# Altium schematic sheet 05_LMS7002M_Misc.SchDoc: LMS7002M misc
size A3; Organization: Lime Microsystems; Address1: Surrey Tech Centre; Address2: Guildford GU2 7YG; Address3: Surrey; Address4: United Kingdom; Revision: v1.0; SheetNumber: 5; SheetTotal: 10
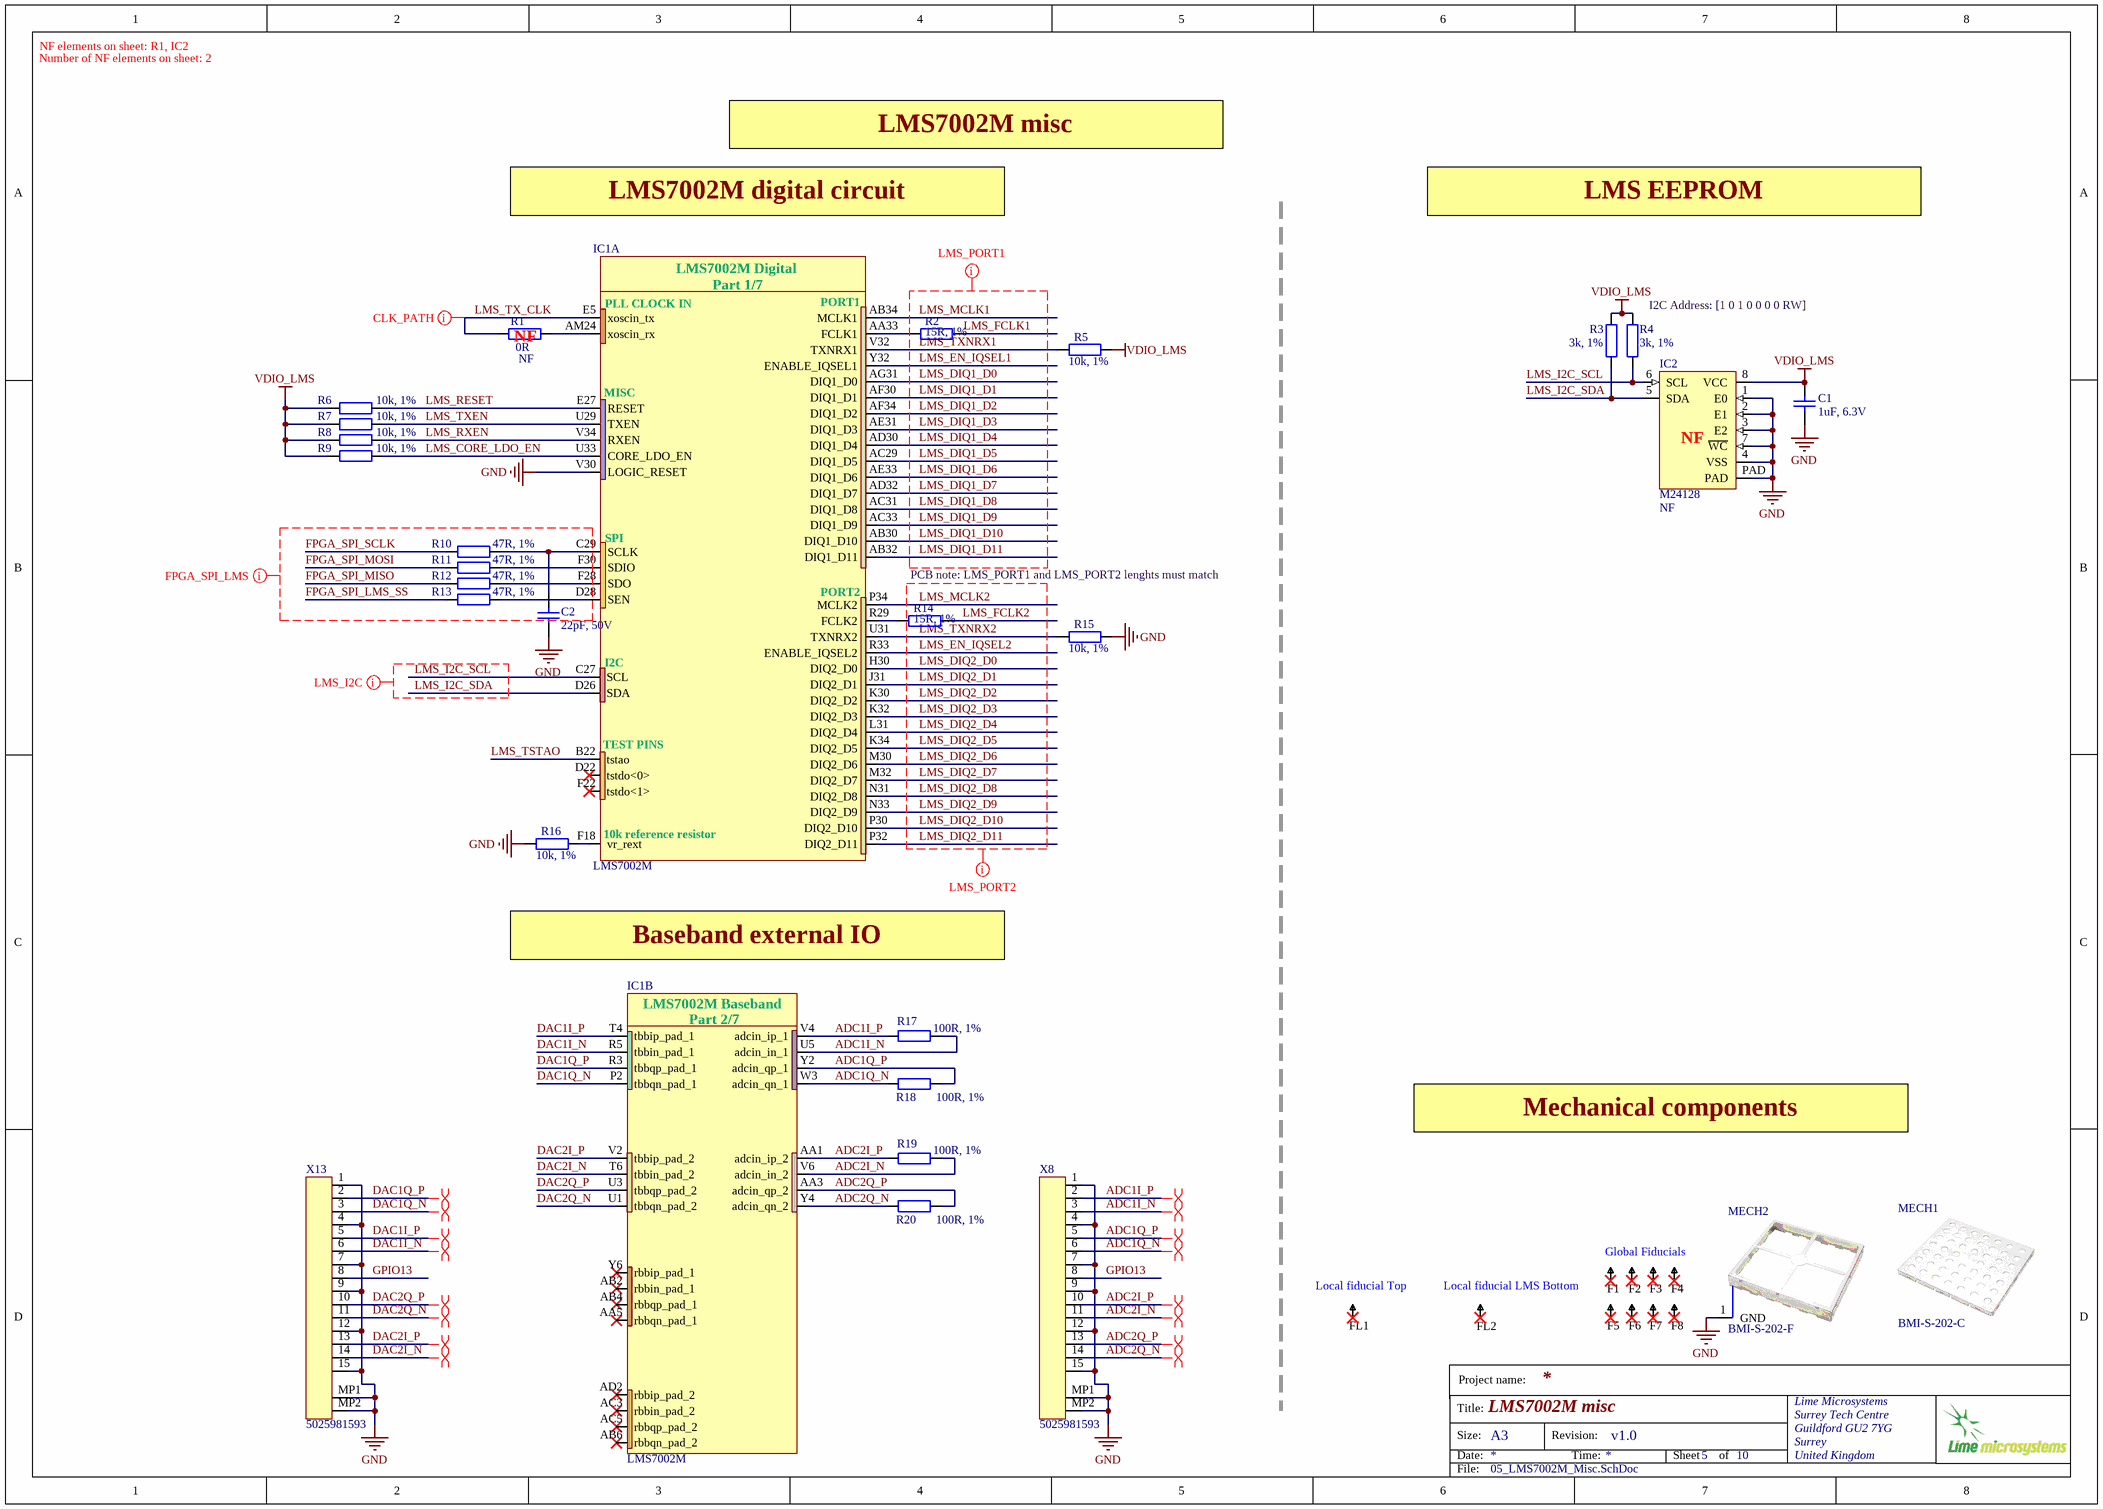
[diagram p0: 05_LMS7002M_Misc.SchDoc]

## Parts
C1  1uF, 6.3V  [CAP0201]
C2  22pF, 50V  [CAP0201]
F1  Fiducial  [Fiducial]  (value not drawn)
F2  Fiducial  [Fiducial]  (value not drawn)
F3  Fiducial  [Fiducial]  (value not drawn)
F4  Fiducial  [Fiducial]  (value not drawn)
F5  Fiducial  [Fiducial]  (value not drawn)
F6  Fiducial  [Fiducial]  (value not drawn)
F7  Fiducial  [Fiducial]  (value not drawn)
F8  Fiducial  [Fiducial]  (value not drawn)
FL1  Fiducial  [Fiducial_local]  (value not drawn)
FL2  Fiducial  [Fiducial_local]  (value not drawn)
IC1  LMS7002M  [LMS7002M_v5_LESS_SILK]  (parts A,B of 7)
IC2  M24128  Assembly Info: NF  [M24128-DFMC6TG]
MECH1  BMI-S-202-C  [BMI-S-202-C_RF_SHIELD_COVER]
MECH2  BMI-S-202-F  [BMI-S-202-F_RF_SHIELD_FRAME_v2]
R1  0R  Assembly Info: NF  [RES0201]
R2  15R, 1%  [RES0201]
R3  3k, 1%  [RES0201]
R4  3k, 1%  [RES0201]
R5  10k, 1%  [RES0201]
R6  10k, 1%  [RES0201]
R7  10k, 1%  [RES0201]
R8  10k, 1%  [RES0201]
R9  10k, 1%  [RES0201]
R10  47R, 1%  [RES0201]
R11  47R, 1%  [RES0201]
R12  47R, 1%  [RES0201]
R13  47R, 1%  [RES0201]
R14  15R, 1%  [RES0201]
R15  10k, 1%  [RES0201]
R16  10k, 1%  [RES0201]
R17  100R, 1%  [RES0201]
R18  100R, 1%  [RES0201]
R19  100R, 1%  [RES0201]
R20  100R, 1%  [RES0201]
X8  5025981593  [5025981593_FPC_connector]
X13  5025981593  [5025981593_FPC_connector]

## Nets
GND: C1.2 C2.1 IC1.V30(LOGIC_RESET) IC2.1(E0) IC2.2(E1) IC2.3(E2) IC2.4(VSS) IC2.7(~{WC}) IC2.PAD MECH2.1(GND) R15.1 R16.2 X8.1 X8.4 X8.7 X8.9 X8.12 X8.15 X8.MP1 X8.MP2 X13.1 X13.4 X13.7 X13.9 X13.12 X13.15 X13.MP1 X13.MP2
VDIO_LMS: C1.1 IC2.8(VCC) R3.2 R4.2 R5.1 R6.2 R7.2 R8.2 R9.2
ADC1I_N: IC1.U5(adcin_in_1) R17.2 X8.3
ADC1I_P: IC1.V4(adcin_ip_1) R17.1 X8.2
ADC1Q_N: IC1.W3(adcin_qn_1) R18.1 X8.6
ADC1Q_P: IC1.Y2(adcin_qp_1) R18.2 X8.5
ADC2I_N: IC1.V6(adcin_in_2) R19.2 X8.11
ADC2I_P: IC1.AA1(adcin_ip_2) R19.1 X8.10
ADC2Q_N: IC1.Y4(adcin_qn_2) R20.1 X8.14
ADC2Q_P: IC1.AA3(adcin_qp_2) R20.2 X8.13
DAC1I_N: IC1.R5(tbbin_pad_1) X13.6
DAC1I_P: IC1.T4(tbbip_pad_1) X13.5
DAC1Q_N: IC1.P2(tbbqn_pad_1) X13.3
DAC1Q_P: IC1.R3(tbbqp_pad_1) X13.2
DAC2I_N: IC1.T6(tbbin_pad_2) X13.14
DAC2I_P: IC1.V2(tbbip_pad_2) X13.13
DAC2Q_N: IC1.U1(tbbqn_pad_2) X13.11
DAC2Q_P: IC1.U3(tbbqp_pad_2) X13.10
FPGA_SPI_LMS_SS: R13.2
FPGA_SPI_MISO: R12.2
FPGA_SPI_MOSI: R11.2
FPGA_SPI_SCLK: R10.2
GPIO13: X8.8 X13.8
LMS_CORE_LDO_EN: IC1.U33(CORE_LDO_EN) R9.1
LMS_DIQ1_D0: IC1.AG31(DIQ1_D0)
LMS_DIQ1_D1: IC1.AF30(DIQ1_D1)
LMS_DIQ1_D2: IC1.AF34(DIQ1_D2)
LMS_DIQ1_D3: IC1.AE31(DIQ1_D3)
LMS_DIQ1_D4: IC1.AD30(DIQ1_D4)
LMS_DIQ1_D5: IC1.AC29(DIQ1_D5)
LMS_DIQ1_D6: IC1.AE33(DIQ1_D6)
LMS_DIQ1_D7: IC1.AD32(DIQ1_D7)
LMS_DIQ1_D8: IC1.AC31(DIQ1_D8)
LMS_DIQ1_D9: IC1.AC33(DIQ1_D9)
LMS_DIQ1_D10: IC1.AB30(DIQ1_D10)
LMS_DIQ1_D11: IC1.AB32(DIQ1_D11)
LMS_DIQ2_D0: IC1.H30(DIQ2_D0)
LMS_DIQ2_D1: IC1.J31(DIQ2_D1)
LMS_DIQ2_D2: IC1.K30(DIQ2_D2)
LMS_DIQ2_D3: IC1.K32(DIQ2_D3)
LMS_DIQ2_D4: IC1.L31(DIQ2_D4)
LMS_DIQ2_D5: IC1.K34(DIQ2_D5)
LMS_DIQ2_D6: IC1.M30(DIQ2_D6)
LMS_DIQ2_D7: IC1.M32(DIQ2_D7)
LMS_DIQ2_D8: IC1.N31(DIQ2_D8)
LMS_DIQ2_D9: IC1.N33(DIQ2_D9)
LMS_DIQ2_D10: IC1.P30(DIQ2_D10)
LMS_DIQ2_D11: IC1.P32(DIQ2_D11)
LMS_EN_IQSEL1: IC1.Y32(ENABLE_IQSEL1)
LMS_EN_IQSEL2: IC1.R33(ENABLE_IQSEL2)
LMS_FCLK1: R2.1
LMS_FCLK2: R14.1
LMS_I2C_SCL: IC1.C27(SCL) IC2.6(SCL) R4.1
LMS_I2C_SDA: IC1.D26(SDA) IC2.5(SDA) R3.1
LMS_MCLK1: IC1.AB34(MCLK1)
LMS_MCLK2: IC1.P34(MCLK2)
LMS_RESET: IC1.E27(RESET) R6.1
LMS_RXEN: IC1.V34(RXEN) R8.1
LMS_TSTAO: IC1.B22(tstao)
LMS_TX_CLK: IC1.E5(xoscin_tx) R1.1
LMS_TXEN: IC1.U29(TXEN) R7.1
LMS_TXNRX1: IC1.V32(TXNRX1) R5.2
LMS_TXNRX2: IC1.U31(TXNRX2) R15.2
NetC2_2: C2.2 IC1.C29(SCLK) R10.1
NetIC1_AA33: IC1.AA33(FCLK1) R2.2
NetIC1_AM24: IC1.AM24(xoscin_rx) R1.2
NetIC1_D28: IC1.D28(SEN) R13.1
NetIC1_F18: IC1.F18(vr_rext) R16.1
NetIC1_F28: IC1.F28(SDO) R12.1
NetIC1_F30: IC1.F30(SDIO) R11.1
NetIC1_R29: IC1.R29(FCLK2) R14.2

Not connected (* = marked no-connect by the designer): F1 1*; F2 1*; F3 1*; F4 1*; F5 1*; F6 1*; F7 1*; F8 1*; FL1 1*; FL2 1*; IC1 AA5(rbbqn_pad_1)* AB2(rbbin_pad_1)* AB4(rbbqp_pad_1)* AB6(rbbqn_pad_2)* AC3(rbbin_pad_2)* AC5(rbbqp_pad_2)* AD2(rbbip_pad_2)* D22(tstdo<0>)* F22(tstdo<1>)* Y6(rbbip_pad_1)*

## Layout directives
net class FPGA_SPI_LMS: FPGA_SPI_LMS_SS, FPGA_SPI_MISO, FPGA_SPI_MOSI, FPGA_SPI_SCLK
net class LMS_I2C: LMS_I2C_SCL, LMS_I2C_SDA
net class LMS_PORT1: LMS_DIQ1_D0, LMS_DIQ1_D1, LMS_DIQ1_D2, LMS_DIQ1_D3, LMS_DIQ1_D4, LMS_DIQ1_D5, LMS_DIQ1_D6, LMS_DIQ1_D7, LMS_DIQ1_D8, LMS_DIQ1_D9, LMS_DIQ1_D10, LMS_DIQ1_D11, LMS_EN_IQSEL1, LMS_FCLK1, LMS_MCLK1, LMS_TXNRX1
net class LMS_PORT2: LMS_DIQ2_D0, LMS_DIQ2_D1, LMS_DIQ2_D2, LMS_DIQ2_D3, LMS_DIQ2_D4, LMS_DIQ2_D5, LMS_DIQ2_D6, LMS_DIQ2_D7, LMS_DIQ2_D8, LMS_DIQ2_D9, LMS_DIQ2_D10, LMS_DIQ2_D11, LMS_EN_IQSEL2, LMS_FCLK2, LMS_MCLK2, LMS_TXNRX2
differential pair: ADC1I_N, ADC1I_P, ADC1Q_N, ADC1Q_P, ADC2I_N, ADC2I_P, ADC2Q_N, ADC2Q_P, DAC1I_N, DAC1I_P, DAC1Q_N, DAC1Q_P, DAC2I_N, DAC2I_P, DAC2Q_N, DAC2Q_P
net class CLK_PATH: LMS_TX_CLK

## Notes on the sheet
- Number of NF elements on sheet: 2
- NF elements on sheet: R1, IC2
- LMS7002M misc
- LMS7002M digital circuit
- LMS EEPROM
- (near R4) I2C Address: [1 0 1 0 0 0 0 RW]
- (near R1) NF
- (near IC2) NF
- PCB note: LMS_PORT1 and LMS_PORT2 lenghts must match
- Baseband external IO
- Mechanical components
- Global Fiducials
- (near FL1) Local fiducial Top
- Local fiducial LMS Bottom
- Project name:
- Title:
- Size:
- Date:
- A3
- Revision:
- Time:
- Sheet
- of
- File:
- (in symbol LMS7002Mr4, part A) LMS7002M Digital; Part 1/7; PORT1; PLL CLOCK IN; MISC; SPI; PORT2; I2C; TEST PINS; 10k reference resistor
- (in symbol LMS7002Mr4, part B) LMS7002M Baseband; Part 2/7

## Library data of the parts
C1 = Cap_0402: Manufacturer: TDK Corporation; Manufacturer Part Number 1: JMK063ABJ105MP-F; Part Description: 1µF ±20% 6.3V X5R Ceramic Capacitor -55°C ~ 85°C Surface Mount, MLCC 0201 (0603 Metric) 0.024" L x 0.012" W (0.60mm x 0.30mm); Value: 1uF, 20%; Tolerance: ±20%; Capacitance: 1.0µF; Temperature Coefficient: X5R; Supplier 1: Digi-Key; Supplier Part Number 1: 587-5864-2-ND; Applications: General Purpose; Features: -; Lead Style: -; Ratings: -; Thickness (Max): -; Lead Spacing: -; Height - Seated (Max): -; Size / Dimension: 0.024" L x 0.012" W (0.60mm x 0.30mm); Mounting Type: Surface Mount, MLCC; Operating Temperature: -55°C ~ 85°C; Package / Case: 0201 (0603 Metric); Packaging: Cut Tape (CT); Voltage - Rated: 6.3V; Category: Capacitors; RoHS: RoHS Compliant
C2 = Cap_0402: Manufacturer: Murata; Manufacturer Part Number 1: GRM0335C1H220JA01D; Part Description: 22 pF ±5% 50V Ceramic Capacitor C0G, NP0 0201 (0603 Metric); Tolerance: 5%; Dielectric: C0G; Value: 22pF, 50V; Supplier 1: Digi-Key; Supplier Part Number 1: 490-6123-1-ND; Stock 1: 2966748; Pricing 1: 1=0,10000, 10=0,01300, 50=0,00720, 100=0,00590, 500=0,00424, 1000=0,00333, 2500=0,00303, 5000=0,00279 (USD); RoHS: Yes; Mount: Surface Mount; Case/Package: 0201; Case Code (Metric): 0603; Case Code (Imperial): 0201; Min Operating Temperature: -55°C; Max Operating Temperature: 125°C; Package Quantity: 15000; Capacitance: 22pF; Voltage Rating: 50V; Packaging: Tape and Reel; Termination: SMD/SMT; Voltage: 50V; Voltage Rating (DC): 50V; Series: GRM; Length: 0.6mm; Width: 0.012inch; Height: 0.3mm; Thickness: 0.013inch; Depth: 0.3mm; Lead Free: Lead Free; RoHS Compliant: Yes; ComponentLink1URL: https://datasheet.ciiva.com/6271/partnumbering-e-01-6271146.pdf?src-supplier=Digi-Key; ComponentLink1Description: https://datasheet.ciiva.com/6271/partnumbering-e-01-6271146.pdf?src-supplier=Digi-Key; ComponentLink2URL: https://datasheet.ciiva.com/6271/partnumbering-e-01-6271143.pdf?src-supplier=Digi-Key; ComponentLink2Description: https://datasheet.ciiva.com/6271/partnumbering-e-01-6271143.pdf?src-supplier=Digi-Key; ComponentLink3URL: https://datasheet.ciiva.com/6271/partnumbering-e-01-6271149.pdf?src-supplier=Digi-Key; ComponentLink3Description: https://datasheet.ciiva.com/6271/partnumbering-e-01-6271149.pdf?src-supplier=Digi-Key
IC1 = LMS7002Mr4: Schematic symbol revision 4. Default footprint - 0.31mm pad; Manufacturer: Lime Microsystems; Part Description: IC FPRF Transceiver LMS7002M; 261 pin aQFN; Supplier 1: Lime Microsystems; Supplier Part Number 1: LMS7002M; Manufacturer Part Number 1: LMS7002M
IC2 = M24128-DFMC6TG: Manufacturer: STMicroelectronics; Part Description: EEPROM Memory IC 128Kb (16K x 8) I²C 1MHz 450ns 8-UFDFPN (2x3); Memory Type: Non-Volatile; Memory Format: EEPROM; Memory Size: 128Kb (16K x 8); Write Cycle Time - Word, Page: 5ms; Memory Interface: I²C; Voltage - Supply: 1.7 V ~ 5.5 V; Supplier 1: Digi-Key; Manufacturer Part Number 1: M24128-DFMC6TG; RoHS: RoHS Compliant; Category: Integrated Circuits (ICs); Stock 1: 5894; Pricing 1: 1=0.35, 10=0.348, 100=0.2854, 500=0.27748, 1000=0.27004 (USD); Packaging: Cut Tape (CT); Part Status: Active; Technology: EEPROM; Operating Temperature: -40°C ~ 85°C (TA); Mounting Type: Surface Mount; Package / Case: 8-UFDFN Exposed Pad; Supplier Device Package: 8-UFDFPN (2x3); ComponentLink1URL: http://www.st.com/content/ccc/resource/technical/document/datasheet/59/05/c9/5b/7b/41/48/b6/CD00259167.pdf/files/CD00259167.pdf/jcr:content/translations/en.CD00259167.pdf; ComponentLink1Description: http://www.st.com/content/ccc/resource/technical/document/datasheet/59/05/c9/5b/7b/41/48/b6/CD00259167.pdf/files/CD00259167.pdf/jcr:content/translations/en.CD00259167.pdf; Supplier Part Number 1: 497-15739-1-ND
MECH1 = RFI_SHIELD_COVER_BMI-S-202-C: Part Description: RF Shield Cover 0.668" (16.96mm) X 0.668" (16.96mm) Vent Holes in Pattern Snap Fit; Manufacturer: Laird; ComponentLink1URL: https://www.leadertechinc.com/assets/files/EngineeringDrawings/SMS-206.PDF; ComponentLink1Description: https://www.leadertechinc.com/assets/files/EngineeringDrawings/SMS-206.PDF; Supplier 1: Digi-Key; Supplier Part Number 1: 903-1014-ND; Manufacturer Part Number 1: BMI-S-202-C; Stock 1: 245970; Pricing 1: 1=1,68000, 10=1,51300, 25=1,42760, 100=1,21620, 250=1,14200, 500=0,99924, 1000=0,82795, 2500=0,77085, 5000=0,74230 (USD); RoHS: Yes; Color: Grey; Material: Aluminium; Package Quantity: 1400; Packaging: Bulk; Series: SMT 2 Piece; Length: 16.5mm; Width: 16.5mm; Depth: 3.6mm; ComponentLink2URL: http://www.farnell.com/datasheets/1965028.pdf?src-supplier=Farnell; ComponentLink2Description: http://www.farnell.com/datasheets/1965028.pdf?src-supplier=Farnell; ComponentLink3URL: http://www.mouser.com/ds/2/223/Laird_BMIS_201_210-201562.pdf?src-supplier=Mouser; ComponentLink3Description: http://www.mouser.com/ds/2/223/Laird_BMIS_201_210-201562.pdf?src-supplier=Mouser; ComponentLink4URL: http://www.farnell.com/datasheets/1965028.pdf?src-supplier=Newark; ComponentLink4Description: http://www.farnell.com/datasheets/1965028.pdf?src-supplier=Newark; ComponentLink5URL: http://www.farnell.com/datasheets/1965028.pdf?src-supplier=Element14; ComponentLink5Description: http://www.farnell.com/datasheets/1965028.pdf?src-supplier=Element14; ComponentLink6URL: http://assets.lairdtech.com/home/brandworld/files/Board%20Level%20Shields%20Catalog%20Download.pdf?src-supplier=Digi-Key; ComponentLink6Description: http://assets.lairdtech.com/home/brandworld/files/Board%20Level%20Shields%20Catalog%20Download.pdf?src-supplier=Digi-Key; ComponentLink7URL: http://assets.lairdtech.com/home/brandworld/files/Board%20Level%20Shields%20Catalog%20Download.pdf?src-supplier=Quest; ComponentLink7Description: http://assets.lairdtech.com/home/brandworld/files/Board%20Level%20Shields%20Catalog%20Download.pdf?src-supplier=Quest
MECH2 = RFI_SHIELD_FRAME_BMI-S-202-F: Part Description: RF Shield Frame 0.650" (16.50mm) X 0.650" (16.50mm) Surface Mount; Manufacturer: Laird; ComponentLink1URL: https://www.leadertechinc.com/assets/files/EngineeringDrawings/SMS-206.PDF; ComponentLink1Description: https://www.leadertechinc.com/assets/files/EngineeringDrawings/SMS-206.PDF; Supplier 1: Digi-Key; Supplier Part Number 1: 903-1051-1-ND; Manufacturer Part Number 1: BMI-S-202-F; Stock 1: 239502; Pricing 1: 1=1,94000, 10=1,74100, 25=1,64280, 100=1,39970, 250=1,31428 (USD); RoHS: Yes; Mount: Solder; Material: Aluminium; Color: Grey; Package Quantity: 700; Packaging: Tape and Reel; Length: 16.5mm; Width: 16.5mm; Depth: 3.6mm; Reach SVHC Compliant: Unknown; ComponentLink2URL: https://datasheet.ciiva.com/2799/bmi-s-202-2799404.pdf?src-supplier=Digi-Key; ComponentLink2Description: https://datasheet.ciiva.com/2799/bmi-s-202-2799404.pdf?src-supplier=Digi-Key
R1 = Res_0402: Part Description: 0 Ohms Jumper Chip Resistor 0201 (0603 Metric) Moisture Resistant Thick Film; Manufacturer: Yageo; Manufacturer Part Number 1: RC0201JR-070RL; Power Rating: 50mW; Tolerance: 5%; Voltage Rating: 25V; ComponentLink1URL: http://www.yageo.com/documents/recent/PYu-RC_Group_51_RoHS_L_7.pdf; ComponentLink1Description: http://www.yageo.com/documents/recent/PYu-RC_Group_51_RoHS_L_7.pdf; Value: 0R; Supplier 1: Digi-Key; Supplier Part Number 1: 311-0.0NCT-ND; Stock 1: 6252381; Pricing 1: 1=0,10000, 10=0,03700, 25=0,02680, 50=0,02020, 100=0,01500, 250=0,01140, 500=0,00912, 1000=0,00672, 5000=0,00482 (USD); RoHS: Yes; Case/Package: 0201; Case Code (Metric): 0603; Case Code (Imperial): 0201; Weight: 6E-06oz; Contact Plating: Tin,Matte; Size Code: 0201; Min Operating Temperature: -55°C; Max Operating Temperature: 125°C; Packaging: Tape and Reel; Resistance: 0R; Package Quantity: 1; Resistor Type: Thick Film; Number of Terminations: 2; Termination: SMD/SMT; Max Power Dissipation: 50mW; Voltage Rating (DC): 25V; Features: Moisture Resistant; Series: RC; Construction: Rectangular; Resistance Tolerance: 5%; Length: 0.024inch; Width: 0.012inch; Height: 0.01inch; Depth: 0.3mm; Radiation Hardening: No; Military Standard: Not; Lead Free: Lead Free; RoHS Compliant: Yes; ComponentLink2URL: https://datasheet.ciiva.com/7672/1563626-7672248.pdf?src-supplier=Element14; ComponentLink2Description: https://datasheet.ciiva.com/7672/1563626-7672248.pdf?src-supplier=Element14; ComponentLink3URL: https://datasheet.ciiva.com/7672/1563626-7672247.pdf?src-supplier=Element14; ComponentLink3Description: https://datasheet.ciiva.com/7672/1563626-7672247.pdf?src-supplier=Element14; ComponentLink4URL: https://datasheet.ciiva.com/7660/1421516-7660808.pdf?src-supplier=Element14; ComponentLink4Description: https://datasheet.ciiva.com/7660/1421516-7660808.pdf?src-supplier=Element14; ComponentLink5URL: https://datasheet.ciiva.com/46391/1421516-46391340.pdf?src-supplier=Element14; ComponentLink5Description: https://datasheet.ciiva.com/46391/1421516-46391340.pdf?src-supplier=Element14
R2 R14 = Res_0402: Manufacturer: Yageo; Manufacturer Part Number 1: RC0201FR-0715RL; Part Description: 15 Ohms ±1% 0.05W, 1/20W Chip Resistor 0201 (0603 Metric) Moisture Resistant Thick Film; Power Rating: 50mW; Voltage Rating: 25V; Temperature Coefficient: 200ppm/°C; Value: 15R, 1%; ComponentLink1URL: https://datasheet.ciiva.com/5924/1563626-5924912.pdf?src-supplier=Farnell; ComponentLink1Description: https://datasheet.ciiva.com/5924/1563626-5924912.pdf?src-supplier=Farnell; ComponentLink2URL: https://datasheet.ciiva.com/22661/1563626-22661319.pdf?src-supplier=Element14; ComponentLink2Description: https://datasheet.ciiva.com/22661/1563626-22661319.pdf?src-supplier=Element14; Supplier 1: Digi-Key; Supplier Part Number 1: 311-15.0MCT-ND; Stock 1: 379739; Pricing 1: 1=0,10000, 10=0,03700, 100=0,01530, 1000=0,00685, 2500=0,00595, 5000=0,00491 (USD); RoHS: Yes; Case/Package: 0201; Case Code (Imperial): 0201; Case Code (Metric): 0603; Size Code: 0201; Min Operating Temperature: -55°C; Max Operating Temperature: 125°C; Resistance: 15R; Tolerance: 1%; Packaging: Cut Tape; Package Quantity: 1; Termination: SMD/SMT; Resistor Type: Thick Film; Number of Terminations: 2; Max Power Dissipation: 50mW; Features: Moisture Resistant; Series: RC; Resistance Tolerance: 1%; Length: 0.6mm; Width: 0.3mm; Height: 0.23mm; Lead Free: Lead Free; RoHS Compliant: Yes; ComponentLink3URL: https://datasheet.ciiva.com/7672/1563626-7672202.pdf?src-supplier=Element14; ComponentLink3Description: https://datasheet.ciiva.com/7672/1563626-7672202.pdf?src-supplier=Element14; ComponentLink4URL: https://datasheet.ciiva.com/2493/pyu-r-int-thick-7-2493785.pdf?src-supplier=Digi-Key; ComponentLink4Description: https://datasheet.ciiva.com/2493/pyu-r-int-thick-7-2493785.pdf?src-supplier=Digi-Key; ComponentLink5URL: https://datasheet.ciiva.com/2493/pyu-r-int-thick-7-2493786.pdf?src-supplier=Digi-Key; ComponentLink5Description: https://datasheet.ciiva.com/2493/pyu-r-int-thick-7-2493786.pdf?src-supplier=Digi-Key; ComponentLink6URL: https://datasheet.ciiva.com/2493/pyu-r-int-thick-7-2493784.pdf?src-supplier=Digi-Key; ComponentLink6Description: https://datasheet.ciiva.com/2493/pyu-r-int-thick-7-2493784.pdf?src-supplier=Digi-Key
R3 R4 = Res_0402: Part Description: 3 kOhms ±1% 0.05W, 1/20W Chip Resistor 0201 (0603 Metric) Moisture Resistant Thick Film; Manufacturer: Yageo; Manufacturer Part Number 1: RC0201FR-073KL; Resistance: 3kR; Max Power Dissipation: 50mW; Temperature Coefficient: 200ppm/°C; Value: 3k, 1%; Supplier 1: Digi-Key; Supplier Part Number 1: YAG2656CT-ND; Stock 1: 269780; Pricing 1: 1=0,10000, 10=0,03700, 100=0,01530, 1000=0,00685, 2500=0,00595, 5000=0,00491 (USD); RoHS: Yes; Case/Package: 0201; Case Code (Metric): 0603; Case Code (Imperial): 0201; Min Operating Temperature: -55°C; Max Operating Temperature: 125°C; Packaging: Tape and Reel; Resistor Type: Thick Film; Number of Terminations: 2; Tolerance: 1%; Features: Moisture Resistant; Length: 0.024inch; Width: 0.012inch; Height: 0.01inch; RoHS Compliant: Yes; ComponentLink1URL: http://www.yageo.com/documents/recent/PYu-RC_Group_51_RoHS_L_10.pdf?src-supplier=Digi-Key; ComponentLink1Description: http://www.yageo.com/documents/recent/PYu-RC_Group_51_RoHS_L_10.pdf?src-supplier=Digi-Key; ComponentLink2URL: http://www.yageo.com.tw/exep/pages/download/literatures/PYu-R_INT-thick_7.pdf?src-supplier=Digi-Key; ComponentLink2Description: http://www.yageo.com.tw/exep/pages/download/literatures/PYu-R_INT-thick_7.pdf?src-supplier=Digi-Key; ComponentLink3URL: http://www.yageo.com/documents/recent/PYu-RC_Group_51_RoHS_L_9.pdf?src-supplier=Digi-Key; ComponentLink3Description: http://www.yageo.com/documents/recent/PYu-RC_Group_51_RoHS_L_9.pdf?src-supplier=Digi-Key
R5-R9 R15 R16 = Res_0402: Manufacturer: Yageo; Manufacturer Part Number 1: RC0201FR-0710KL; Part Description: 10 kOhms ±1% 0.05W, 1/20W Chip Resistor 0201 (0603 Metric) Moisture Resistant Thick Film; Resistance: 10kR; Power Rating: 50mW; Voltage Rating: 25V; Temperature Coefficient: 200ppm/°C; Value: 10k, 1%; ComponentLink1URL: https://datasheet.ciiva.com/5924/1563626-5924912.pdf?src-supplier=Farnell; ComponentLink1Description: https://datasheet.ciiva.com/5924/1563626-5924912.pdf?src-supplier=Farnell; ComponentLink2URL: https://datasheet.ciiva.com/22661/1563626-22661319.pdf?src-supplier=Element14; ComponentLink2Description: https://datasheet.ciiva.com/22661/1563626-22661319.pdf?src-supplier=Element14; Supplier 1: Digi-Key; Supplier Part Number 1: 311-10.0KMCT-ND; Stock 1: 17142315; Pricing 1: 1=0,10000, 10=0,03700, 100=0,01530, 1000=0,00685, 2500=0,00595, 5000=0,00491 (USD); RoHS: Yes; Case/Package: 0201; Number of Pins: 2; Case Code (Imperial): 0201; Case Code (Metric): 0603; Contact Plating: Tin,Matte; Weight: 6E-06oz; Min Operating Temperature: -55°C; Max Operating Temperature: 125°C; Tolerance: 1%; Packaging: Tape and Reel; Package Quantity: 10000; Termination: SMD/SMT; Resistor Type: Thick Film; Number of Terminations: 2; Max Power Dissipation: 50mW; Voltage Rating (DC): 25V; Features: Moisture Resistant; Series: RC; Resistance Tolerance: 1%; Construction: Rectangular; Working Voltage: 25V; Technology: THICK FILM; Length: 0.6mm; Width: 0.012inch; Height: 0.01inch; Depth: 0.3mm; Radiation Hardening: No; Reach SVHC Compliant: Yes; Military Standard: Not; Lead Free: Lead Free; RoHS Compliant: Yes; ComponentLink3URL: https://datasheet.ciiva.com/7660/1421516-7660807.pdf?src-supplier=Element14; ComponentLink3Description: https://datasheet.ciiva.com/7660/1421516-7660807.pdf?src-supplier=Element14; ComponentLink4URL: https://datasheet.ciiva.com/46391/1421516-46391339.pdf?src-supplier=Element14; ComponentLink4Description: https://datasheet.ciiva.com/46391/1421516-46391339.pdf?src-supplier=Element14; ComponentLink5URL: https://datasheet.ciiva.com/2467/pyu-r-int-thick-7-2467110.pdf?src-supplier=Digi-Key; ComponentLink5Description: https://datasheet.ciiva.com/2467/pyu-r-int-thick-7-2467110.pdf?src-supplier=Digi-Key; ComponentLink6URL: https://datasheet.ciiva.com/2467/pyu-r-int-thick-7-2467111.pdf?src-supplier=Digi-Key; ComponentLink6Description: https://datasheet.ciiva.com/2467/pyu-r-int-thick-7-2467111.pdf?src-supplier=Digi-Key; ComponentLink7URL: https://datasheet.ciiva.com/2467/pyu-r-int-thick-7-2467109.pdf?src-supplier=Digi-Key; ComponentLink7Description: https://datasheet.ciiva.com/2467/pyu-r-int-thick-7-2467109.pdf?src-supplier=Digi-Key
R10-R13 = Res_0402: Manufacturer: Yageo; Manufacturer Part Number 1: RC0201FR-0747RL; Part Description: 47 Ohms ±1% 0.05W, 1/20W Chip Resistor 0201 (0603 Metric) Moisture Resistant Thick Film; Power Rating: 50mW; Voltage Rating: 25V; Temperature Coefficient: 200ppm/°C; Value: 47R, 1%; Supplier 1: Digi-Key; Supplier Part Number 1: YAG2694CT-ND; Stock 1: 778022; Pricing 1: 1=0,10000, 10=0,03700, 100=0,01530, 1000=0,00685, 2500=0,00595, 5000=0,00491 (USD); RoHS: Yes; Case/Package: 0201; Case Code (Imperial): 0201; Case Code (Metric): 0603; Min Operating Temperature: -55°C; Max Operating Temperature: 125°C; Packaging: Tape and Reel; Resistance: 47R; Tolerance: 1%; Resistor Type: Thick Film; Termination: SMD/SMT; Number of Terminations: 2; Max Power Dissipation: 50mW; Features: Moisture Resistant; Series: RC; Resistance Tolerance: 1%; Length: 0.6mm; Width: 0.3mm; Height: 0.23mm; Reach SVHC Compliant: Yes; RoHS Compliant: Yes; ComponentLink1URL: https://datasheet.ciiva.com/5924/1563626-5924912.pdf?src-supplier=Farnell; ComponentLink1Description: https://datasheet.ciiva.com/5924/1563626-5924912.pdf?src-supplier=Farnell; ComponentLink2URL: https://datasheet.ciiva.com/22661/1563626-22661319.pdf?src-supplier=Element14; ComponentLink2Description: https://datasheet.ciiva.com/22661/1563626-22661319.pdf?src-supplier=Element14
R17-R20 = Res_0402: Manufacturer: Yageo; Manufacturer Part Number 1: RC0201FR-07100RL; Part Description: 100 Ohms ±1% 0.05W, 1/20W Chip Resistor 0201 (0603 Metric) Moisture Resistant Thick Film; Power Rating: 50mW; Voltage Rating: 25V; Temperature Coefficient: 200ppm/°C; ComponentLink1URL: http://www.yageo.com/documents/recent/PYu-RC_Group_51_RoHS_L_7.pdf; ComponentLink1Description: http://www.yageo.com/documents/recent/PYu-RC_Group_51_RoHS_L_7.pdf; Value: 100R, 1%; Supplier 1: Digi-Key; Supplier Part Number 1: 311-100MCT-ND; Stock 1: 1625377; Pricing 1: 1=0,10000, 10=0,03700, 100=0,01530, 1000=0,00685, 2500=0,00595, 5000=0,00491 (USD); RoHS: Yes; Case/Package: 0201; Case Code (Metric): 0603; Case Code (Imperial): 0201; Contact Plating: Tin,Matte; Size Code: 0201; Min Operating Temperature: -55°C; Max Operating Temperature: 125°C; Resistance: 100R; Tolerance: 1%; Packaging: Cut Tape; Package Quantity: 1; Resistor Type: Thick Film; Number of Terminations: 2; Termination: SMD/SMT; Max Power Dissipation: 50mW; Features: Moisture Resistant; Series: RC; Resistance Tolerance: 1%; Length: 0.024inch; Width: 0.012inch; Height: 0.01inch; Radiation Hardening: No; Lead Free: Lead Free; RoHS Compliant: Yes; ComponentLink2URL: https://datasheet.ciiva.com/2560/pyu-r-int-thick-7-2560866.pdf?src-supplier=Digi-Key; ComponentLink2Description: https://datasheet.ciiva.com/2560/pyu-r-int-thick-7-2560866.pdf?src-supplier=Digi-Key; ComponentLink3URL: https://datasheet.ciiva.com/2560/pyu-r-int-thick-7-2560867.pdf?src-supplier=Digi-Key; ComponentLink3Description: https://datasheet.ciiva.com/2560/pyu-r-int-thick-7-2560867.pdf?src-supplier=Digi-Key; ComponentLink4URL: https://datasheet.ciiva.com/2560/pyu-r-int-thick-7-2560865.pdf?src-supplier=Digi-Key; ComponentLink4Description: https://datasheet.ciiva.com/2560/pyu-r-int-thick-7-2560865.pdf?src-supplier=Digi-Key; ComponentLink5URL: https://datasheet.ciiva.com/8887/pyu-rc0201-51-rohs-l-8-8887865.pdf?src-supplier=Avnet; ComponentLink5Description: https://datasheet.ciiva.com/8887/pyu-rc0201-51-rohs-l-8-8887865.pdf?src-supplier=Avnet
X8 X13 = 5025981593_FPC_connector: Part Description: 15 Position FPC Connector Contacts, Top and Bottom 0.012" (0.30mm) Surface Mount, Right Angle; Manufacturer: Molex; Supplier 1: Digi-Key; Supplier Part Number 1: 900-5025981593CT-ND; Manufacturer Part Number 1: 5025981593; Stock 1: 19758; Pricing 1: 1=1,40000, 10=1,15900, 100=0,96600, 1000=0,77280 (USD); RoHS: Yes